# EAGLE schematic tick-mk-1 (EAGLE 6.5.0)
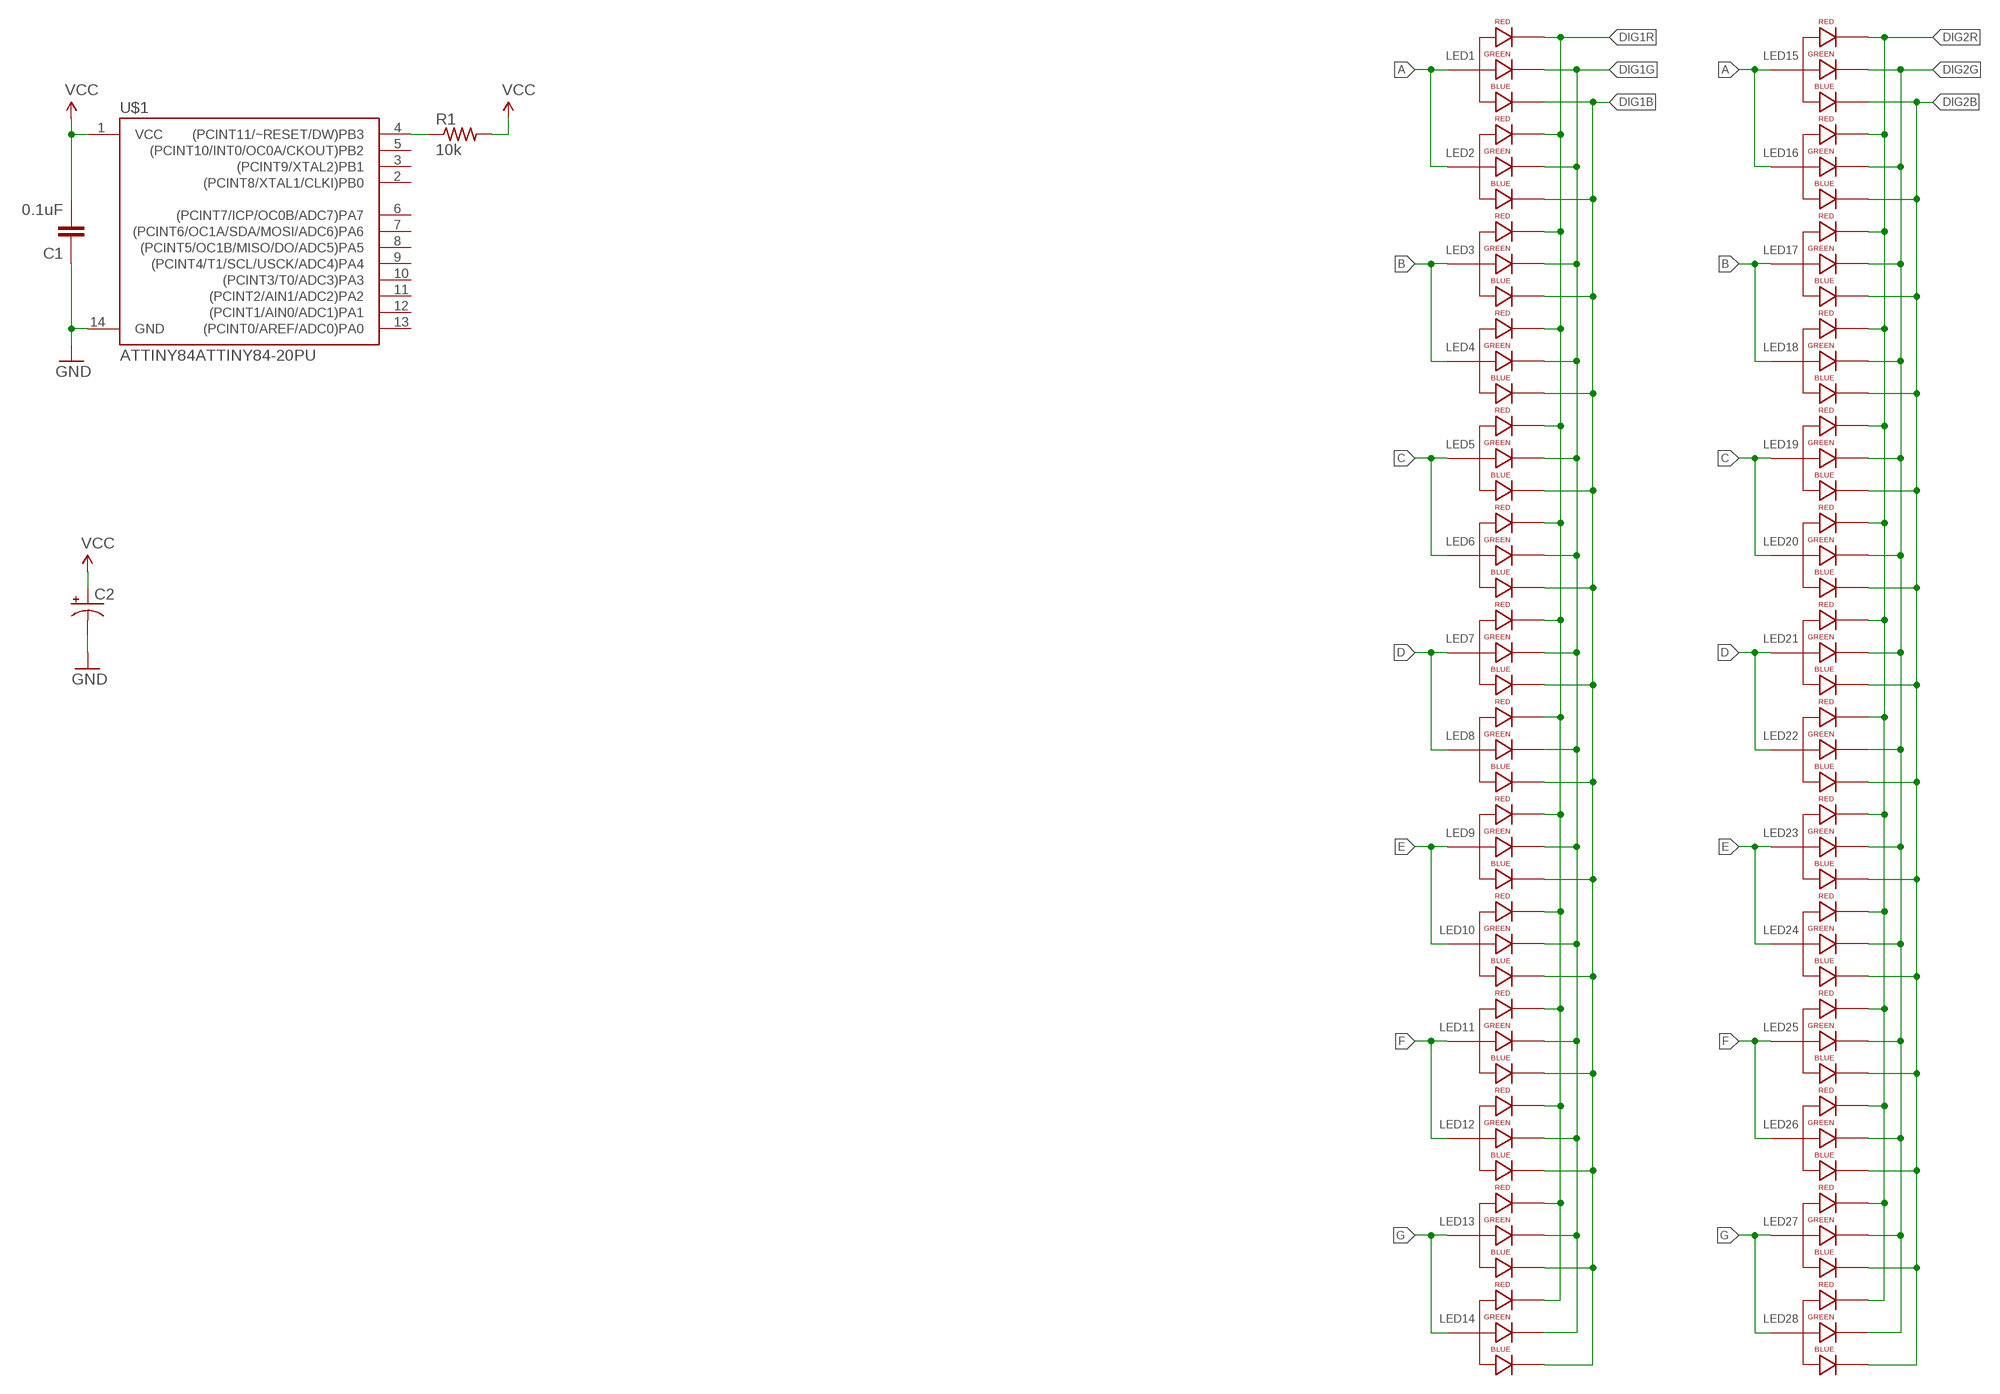
[diagram p0: schematic, sheet 1]

## Parts
C1  0.1uF  CAPACITOR-CERAMIC025-024X044  [C025-024X044]
C2  CAPACITOR-POLARIZEDE2-5  [E2-5]
LED1  LED-RGB-CA-THRUCLEAR  [LED-RGB-THRU]
LED2  LED-RGB-CA-THRUCLEAR  [LED-RGB-THRU]
LED3  LED-RGB-CA-THRUCLEAR  [LED-RGB-THRU]
LED4  LED-RGB-CA-THRUCLEAR  [LED-RGB-THRU]
LED5  LED-RGB-CA-THRUCLEAR  [LED-RGB-THRU]
LED6  LED-RGB-CA-THRUCLEAR  [LED-RGB-THRU]
LED7  LED-RGB-CA-THRUCLEAR  [LED-RGB-THRU]
LED8  LED-RGB-CA-THRUCLEAR  [LED-RGB-THRU]
LED9  LED-RGB-CA-THRUCLEAR  [LED-RGB-THRU]
LED10  LED-RGB-CA-THRUCLEAR  [LED-RGB-THRU]
LED11  LED-RGB-CA-THRUCLEAR  [LED-RGB-THRU]
LED12  LED-RGB-CA-THRUCLEAR  [LED-RGB-THRU]
LED13  LED-RGB-CA-THRUCLEAR  [LED-RGB-THRU]
LED14  LED-RGB-CA-THRUCLEAR  [LED-RGB-THRU]
LED15  LED-RGB-CA-THRUCLEAR  [LED-RGB-THRU]
LED16  LED-RGB-CA-THRUCLEAR  [LED-RGB-THRU]
LED17  LED-RGB-CA-THRUCLEAR  [LED-RGB-THRU]
LED18  LED-RGB-CA-THRUCLEAR  [LED-RGB-THRU]
LED19  LED-RGB-CA-THRUCLEAR  [LED-RGB-THRU]
LED20  LED-RGB-CA-THRUCLEAR  [LED-RGB-THRU]
LED21  LED-RGB-CA-THRUCLEAR  [LED-RGB-THRU]
LED22  LED-RGB-CA-THRUCLEAR  [LED-RGB-THRU]
LED23  LED-RGB-CA-THRUCLEAR  [LED-RGB-THRU]
LED24  LED-RGB-CA-THRUCLEAR  [LED-RGB-THRU]
LED25  LED-RGB-CA-THRUCLEAR  [LED-RGB-THRU]
LED26  LED-RGB-CA-THRUCLEAR  [LED-RGB-THRU]
LED27  LED-RGB-CA-THRUCLEAR  [LED-RGB-THRU]
LED28  LED-RGB-CA-THRUCLEAR  [LED-RGB-THRU]
R1  10k  RESISTORPTH-AXIAL-5.08MM  [RESISTOR-AXIAL-PTH-5.08MM]
U$1  ATTINY84ATTINY84-20PU  [DIL14]

## Nets
A: LED1.2(ANODE) LED2.2(ANODE) LED15.2(ANODE) LED16.2(ANODE)
B: LED3.2(ANODE) LED4.2(ANODE) LED17.2(ANODE) LED18.2(ANODE)
C: LED5.2(ANODE) LED6.2(ANODE) LED19.2(ANODE) LED20.2(ANODE)
D: LED7.2(ANODE) LED8.2(ANODE) LED21.2(ANODE) LED22.2(ANODE)
DIG1B: LED1.4(BLUE_CATHODE) LED2.4(BLUE_CATHODE) LED3.4(BLUE_CATHODE) LED4.4(BLUE_CATHODE) LED5.4(BLUE_CATHODE) LED6.4(BLUE_CATHODE) LED7.4(BLUE_CATHODE) LED8.4(BLUE_CATHODE) LED9.4(BLUE_CATHODE) LED10.4(BLUE_CATHODE) LED11.4(BLUE_CATHODE) LED12.4(BLUE_CATHODE) LED13.4(BLUE_CATHODE) LED14.4(BLUE_CATHODE)
DIG1G: LED1.3(GREEN_CATHODE) LED2.3(GREEN_CATHODE) LED3.3(GREEN_CATHODE) LED4.3(GREEN_CATHODE) LED5.3(GREEN_CATHODE) LED6.3(GREEN_CATHODE) LED7.3(GREEN_CATHODE) LED8.3(GREEN_CATHODE) LED9.3(GREEN_CATHODE) LED10.3(GREEN_CATHODE) LED11.3(GREEN_CATHODE) LED12.3(GREEN_CATHODE) LED13.3(GREEN_CATHODE) LED14.3(GREEN_CATHODE)
DIG1R: LED1.1(RED_CATHODE) LED2.1(RED_CATHODE) LED3.1(RED_CATHODE) LED4.1(RED_CATHODE) LED5.1(RED_CATHODE) LED6.1(RED_CATHODE) LED7.1(RED_CATHODE) LED8.1(RED_CATHODE) LED9.1(RED_CATHODE) LED10.1(RED_CATHODE) LED11.1(RED_CATHODE) LED12.1(RED_CATHODE) LED13.1(RED_CATHODE) LED14.1(RED_CATHODE)
DIG2B: LED15.4(BLUE_CATHODE) LED16.4(BLUE_CATHODE) LED17.4(BLUE_CATHODE) LED18.4(BLUE_CATHODE) LED19.4(BLUE_CATHODE) LED20.4(BLUE_CATHODE) LED21.4(BLUE_CATHODE) LED22.4(BLUE_CATHODE) LED23.4(BLUE_CATHODE) LED24.4(BLUE_CATHODE) LED25.4(BLUE_CATHODE) LED26.4(BLUE_CATHODE) LED27.4(BLUE_CATHODE) LED28.4(BLUE_CATHODE)
DIG2G: LED15.3(GREEN_CATHODE) LED16.3(GREEN_CATHODE) LED17.3(GREEN_CATHODE) LED18.3(GREEN_CATHODE) LED19.3(GREEN_CATHODE) LED20.3(GREEN_CATHODE) LED21.3(GREEN_CATHODE) LED22.3(GREEN_CATHODE) LED23.3(GREEN_CATHODE) LED24.3(GREEN_CATHODE) LED25.3(GREEN_CATHODE) LED26.3(GREEN_CATHODE) LED27.3(GREEN_CATHODE) LED28.3(GREEN_CATHODE)
DIG2R: LED15.1(RED_CATHODE) LED16.1(RED_CATHODE) LED17.1(RED_CATHODE) LED18.1(RED_CATHODE) LED19.1(RED_CATHODE) LED20.1(RED_CATHODE) LED21.1(RED_CATHODE) LED22.1(RED_CATHODE) LED23.1(RED_CATHODE) LED24.1(RED_CATHODE) LED25.1(RED_CATHODE) LED26.1(RED_CATHODE) LED27.1(RED_CATHODE) LED28.1(RED_CATHODE)
E: LED9.2(ANODE) LED10.2(ANODE) LED23.2(ANODE) LED24.2(ANODE)
F: LED11.2(ANODE) LED12.2(ANODE) LED25.2(ANODE) LED26.2(ANODE)
G: LED13.2(ANODE) LED14.2(ANODE) LED27.2(ANODE) LED28.2(ANODE)
GND: C1.1 C2.- U$1.14(GND)
N$1: R1.P$1 U$1.4((PCINT11/~RESET/DW)PB3)
VCC: C1.2 C2.+ R1.P$2 U$1.1(VCC)
Unconnected: U$1.2((PCINT8/XTAL1/CLKI)PB0) U$1.3((PCINT9/XTAL2)PB1) U$1.5((PCINT10/INT0/OC0A/CKOUT)PB2) U$1.6((PCINT7/ICP/OC0B/ADC7)PA7) U$1.7((PCINT6/OC1A/SDA/MOSI/ADC6)PA6) U$1.8((PCINT5/OC1B/MISO/DO/ADC5)PA5) U$1.9((PCINT4/T1/SCL/USCK/ADC4)PA4) U$1.10((PCINT3/T0/ADC3)PA3) U$1.11((PCINT2/AIN1/ADC2)PA2) U$1.12((PCINT1/AIN0/ADC1)PA1) U$1.13((PCINT0/AREF/ADC0)PA0)

## Library data of the parts
C1 = A_butts:CAPACITOR-CERAMIC: CAPACITOR, European symbol
C2 = A_butts:CAPACITOR-POLARIZED: POLARIZED CAPACITOR, American symbol
LED1-LED28 = A_butts:LED-RGB-CA-THRU: RGB Through-hole common anode SparkFun store front COM-10821 (diffuse) COM-10820 (clear); PROD_ID: DIO-10631
R1 = A_butts:RESISTOR: RESISTOR, American symbol
U$1 = A_butts:ATTINY84: Atmel 14-pin 2/4/8kB flash uC